# EAGLE design rtlsdr_lna (EAGLE 6.1)
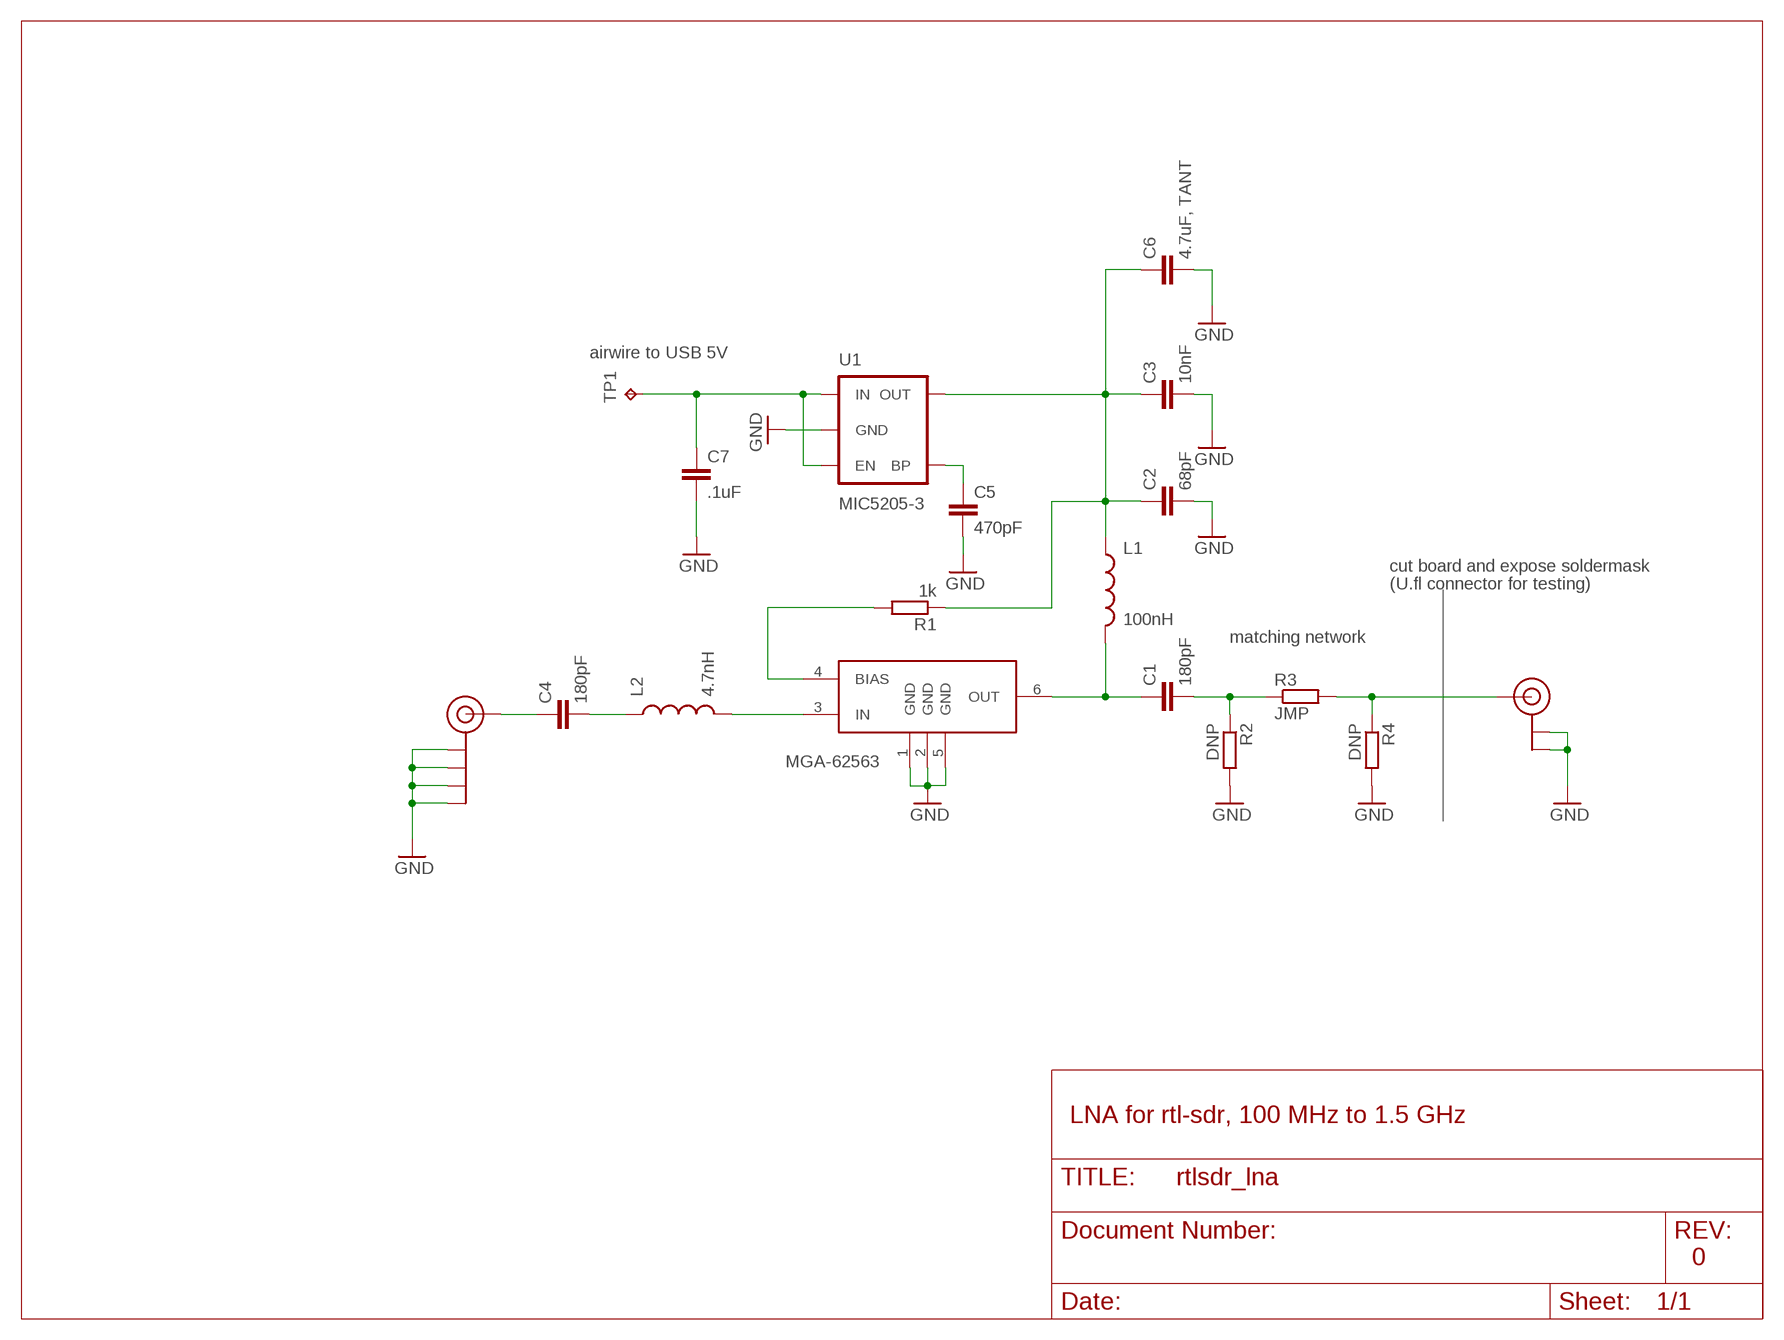
[diagram p0: schematic, sheet 1]

## Parts
C1  180pF  C-EUC0402  [C0402]
C2  68pF  C-EUC0402  [C0402]
C3  10nF  C-EUC0402  [C0402]
C4  180pF  C-EUC0402  [C0402]
C5  470pF  C-EUC0402  [C0402]
C6  4.7uF, TANT  C-EUC0805  [C0805]
C7  .1uF  C-EUC0603  [C0603]
J$1  SMA_EDGE  [SMA-EDGE]
L1  100nH  INDUCTOR0603  [0603]
L2  4.7nH  INDUCTOR0402  [C0402]
R1  1k  R-EU_R0402  [R0402]
R2  DNP  R-EU_R0402  [R0402]
R3  JMP  R-EU_R0402  [R0402]
R4  DNP  R-EU_R0402  [R0402]
TP1  TPTP20SQ  [TP20SQ]
U1  MIC5205-3  V_REG_LDOSMD  [SOT23-5]
U$1  MGA-68563  [SOT363]
U$2  U.FL  [U.FL]

## Nets
GND: C2.2 C3.2 C5.2 C6.2 C7.2 J$1.GND@0(GND) J$1.GND@1(GND) J$1.GND@2(GND) J$1.GND@3(GND) R2.2 R4.2 U1.2(GND) U$1.1(GND) U$1.2(GND) U$1.5(GND) U$2.P$1(GND) U$2.P$2(GND)
N$2: R1.2 U$1.4(BIAS)
N$3: C1.2 R2.1 R3.1
N$4: C1.1 L1.2 U$1.6(OUT)
N$5: R3.2 R4.1 U$2.P$3(SIGNAL)
N$6: C2.1 C3.1 C6.1 L1.1 R1.1 U1.5(OUT)
N$7: C5.1 U1.4(BP)
N$8: C7.1 TP1.TP U1.1(IN) U1.3(EN)
N$10: C4.1 J$1.SIG(SIGNAL)
N$11: C4.2 L2.1
N$12: L2.2 U$1.3(IN)

## Notes on the sheet
- airwire to USB 5V
- cut board and expose soldermask
- (U.fl connector for testing)
- matching network
- MGA-62563
- LNA for rtl-sdr, 100 MHz to 1.5 GHz
- 0

## Library data of the parts
C1-C7 = rcl:C-EU: CAPACITOR, European symbol
J$1 = SparkFun-Connectors:SMA_EDGE: SMA Antenna Connector End launch SMA connector. The paste layer has been removed so that the connector can be hand soldered onto the board after reflow.
L1 L2 = SparkFun-Passives:INDUCTOR: Inductors Basic Inductor/Choke - 0603 and 1206. Footprints are not proven and vary greatly between part numbers.
R1-R4 = rcl:R-EU_: RESISTOR, European symbol
TP1 = testpad:TP: Test pad
U1 = SparkFun-PowerIC:V_REG_LDO: Voltage Regulator LDO Standard 150mA LDO voltage regulator in SOT-23 layout. Micrel part MIC5205. BP (by-pass) pin is used to lower output noise with 470pF cap.
U$1 = mr_radar:MGA-68563
U$2 = SparkFun-Connectors:U.FL: SMD antenna connector- WRL-09144

## Board
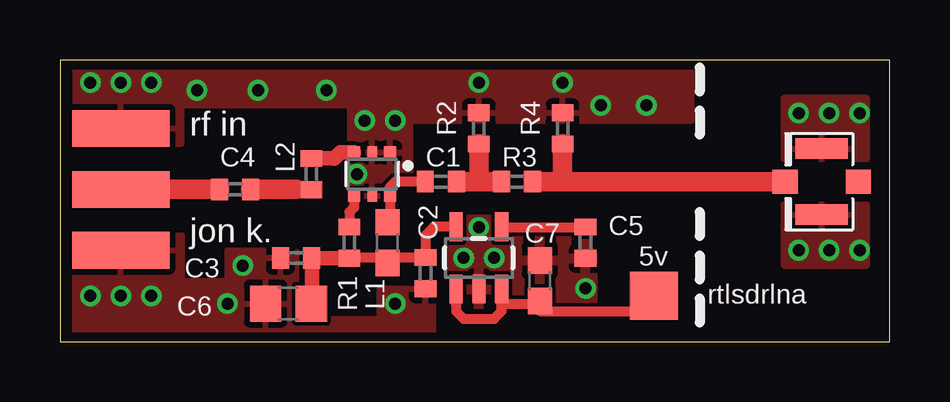
[diagram p1: board, top side]
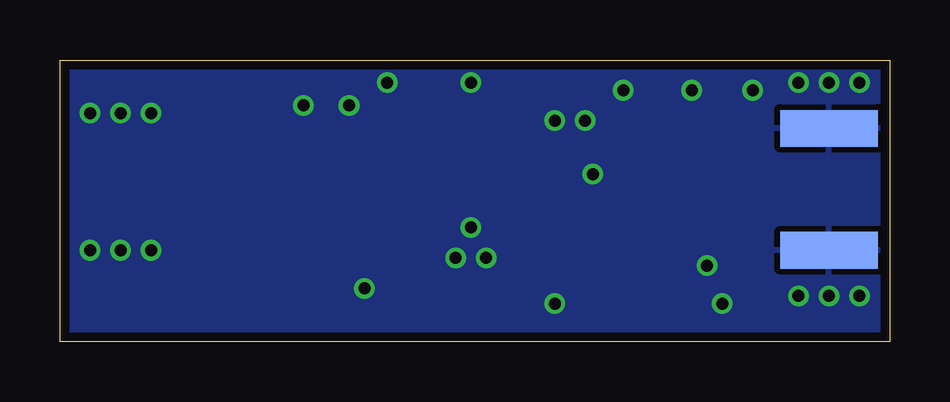
[diagram p2: board, bottom side, seen from below]

Size 34.59 x 11.74 mm. Coordinates in mm from the lower left corner, seen from the top.
Outline: 0,0 34.59,0 34.59,11.74 0,11.74 0,0
Copper layers (1*16): Top 0.0356mm / dielectric 1.5011mm / Bottom 0.0356mm
Design rules "default": minimum track width 6mil, minimum drill 13mil, track to track 6mil, track to pad 6mil, pad to pad 6mil, via to via 6mil, smd to smd 6mil, copper to edge 15mil, drill to drill 6mil, minimum pad ring 7mil, minimum via ring 7mil, stop-mask expansion 4mil, vias tented up to drill 0mil, thermal gap 10mil

### Footprints (pad centres in the part's own frame; a part is rotated, then mirrored left to right if it is on the bottom)
C0402 = smd 0.7 x 0.9: 1 -0.65,0; 2 0.65,0
C0805 = smd 1.3 x 1.5: 1 -0.95,0; 2 0.95,0
C0603 = smd 1.1 x 1: 1 -0.85,0; 2 0.85,0
SMA-EDGE = smd 1.524 x 4.064: GND@0 0,0; GND@1 5.08,0; SIG 2.54,0 | smd 1.524 x 4.064 bottom: GND@2 0,0; GND@3 5.08,0
0603 = smd 1.1 x 1: 1 -0.85,0; 2 0.85,0
R0402 = smd 0.7 x 0.9: 1 -0.65,0; 2 0.65,0
TP20SQ = smd 2 x 2: TP 0,0
SOT23-5 = smd 0.55 x 1.2: 1 -0.95,-1.3; 2 0,-1.3; 3 0.95,-1.3; 4 0.95,1.3; 5 -0.95,1.3
SOT363 = smd 0.5 x 0.5: 1 -0.75,-0.9; 3 0.75,-0.9; 4 0.75,0.9; 6 -0.75,0.9 | smd 0.4 x 0.5: 2 0,-0.9; 5 0,0.9
U.FL = smd 2.2 x 0.85: P$1 0,1.375; P$2 0,-1.375 | smd 1.05 x 1: P$3 1.525,0; P$4 -1.525,0

### Placement (x,y rotation side)
C1  15.88,6.67 0 top
C2  15.24,2.86 270 top
C3  9.84,3.49 180 top
C4  7.3,6.35 0 top
C5  21.91,4.13 270 top
C6  9.53,1.59 180 top
C7  20,2.54 90 top
J$1  2.54,3.81 90 top
L1  13.65,4.13 90 top
L2  10.48,6.99 90 top
R1  12.06,4.13 90 top
R2  17.46,8.89 90 top
R3  19.05,6.67 0 top
R4  20.95,8.89 90 top
TP1  24.77,1.91 0 top
U1  17.46,3.49 0 top
U$1  13.02,6.99 180 top
U$2  31.75,6.67 180 top

### Tracks (layer width: path | path; a pad name or v marks a point on that pad's centre or on a via)
GND  (via drill 0.5)
  other vias: 1.27,10.79 2.54,10.79 12.7,9.21 12.38,6.99 13.97,9.21 17.46,10.79 20.95,10.79 7.62,3.17 6.99,1.59 3.81,1.91 2.54,1.91 1.27,1.91 13.97,1.59 30.8,9.53 32.07,9.53 33.34,9.53 30.8,3.81 32.07,3.81 33.34,3.81 11.11,10.48 8.26,10.48 22.54,9.84 24.45,9.84 18.1,3.49 16.83,3.49 17.46,4.76 21.91,2.22 5.71,10.48 3.81,10.79
  pour Bottom: 0,12.7 0,0 34.61,0 34.61,12.7
  pour Top: 12.06,9.84 12.06,6.03 14.61,6.03 14.61,9.21 26.35,9.21 26.35,12.38 0.64,12.38 0.64,8.26 5.08,8.26 5.08,9.84
  pour Top: 13.34,2.22 15.56,2.22 15.56,0.32 0.64,0.32 0.64,4.45 5.08,4.45 5.08,2.54 6.99,2.54 6.99,3.81 9.84,3.81 9.84,0.95 13.34,0.95
  pour Top: 30.16,5.71 30.16,3.17 33.66,3.17 33.66,5.71
  pour Top: 30.16,10.16 30.16,7.62 33.66,7.62 33.66,10.16
  pour Top: 16.19,5.08 16.19,1.59 22.23,1.59 22.23,5.08
N$2
  Top 0.406: U$1.4 12.27,5.6 12.06,5.4 R1.2
N$3
  Top 0.406: C1.2 16.83,6.67
  Top 0.61: R3.1 18.1,6.67
  Top 0.813: 16.83,6.67 17.46,6.67 | 17.46,6.67 18.1,6.67 | R2.1 17.46,6.67
N$4
  Top 0.406: C1.1 13.97,6.67 13.77,6.46 U$1.6 13.77,4.89 L1.2
N$5
  Top 0.406: R3.2 20,6.67
  Top 0.813: 20,6.67 20.95,6.67 | 20.95,6.67 U$2.P$3 | R4.1 20.95,6.67
N$6
  Top 0.406: U1.5 15.59,4.79 15.24,4.45 C2.1 13.65,3.51 L1.1 arc90 13.44,3.49 12.06,3.49 R1.1
  Top 0.61: R1.1 10.51,3.48 | 10.51,3.48 arc-90 C3.1 | 10.51,3.48 10.51,1.62 arc-90 C6.1
N$7
  Top 0.406: U1.4 18.44,4.76 21.91,4.76 C5.1
N$8
  Top 0.406: 16.51,1.56 U1.1 16.51,1.27 16.83,0.95 18.1,0.95 18.41,1.27 18.41,1.59 | U1.3 18.41,1.59 | 18.41,1.59 20,1.59 | C7.1 20,1.59 | TP1.TP 24.45,1.91 24.45,1.27 20,1.27 20,1.59 | 18.41,2.22 U1.3 | U1.3
N$10
  Top 0.813: J$1.SIG C4.1
N$11
  Top 0.406: 9.84,6.35 10.46,6.35 L2.1
  Top 0.813: C4.2 9.84,6.35
N$12
  Top 0.406: 12.27,7.94 U$1.3
  Top 0.61: L2.2 11.43,7.63 11.43,7.62 11.7,7.88 U$1.3

### Text on the board
_tsilk: rf in | jon k. | 5v | rtlsdrlna